# EAGLE design fridge_hack (EAGLE 9.0.1)
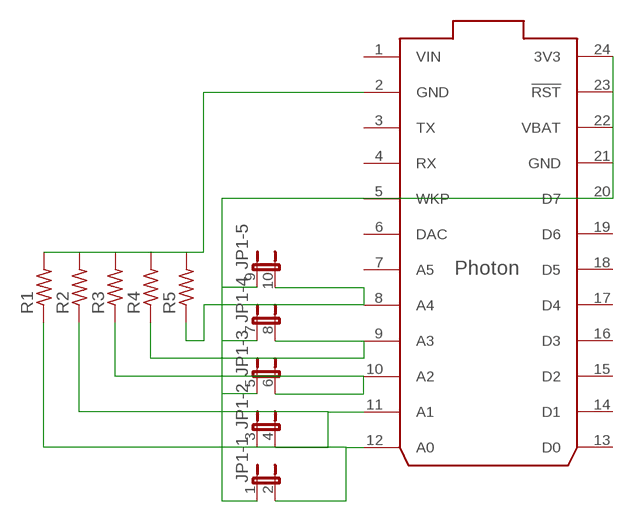
[diagram p0: schematic, sheet 1]

## Parts
JP1  JP5QE  [JP5Q]
R1  R-US_0309/12  [0309/12]
R2  R-US_0309/12  [0309/12]
R3  R-US_0309/12  [0309/12]
R4  R-US_0309/12  [0309/12]
R5  R-US_0309/12  [0309/12]
U$1  PHOTON_WITH_HEADERS  [PHOTON]

## Nets
N$1: R1.2 R2.2 R3.2 R4.2 R5.2 U$1.2(GND)
N$2: JP1.1 JP1.3 JP1.5 JP1.7 JP1.9 U$1.24(3V3)
N$3: JP1.10 R5.1 U$1.8(A4)
N$4: JP1.8 R4.1 U$1.9(A3)
N$5: JP1.6 R3.1 U$1.10(A2)
N$6: JP1.4 R2.1 U$1.11(A1)
N$7: JP1.2 R1.1 U$1.12(A0)
Unconnected: U$1.3(TX) U$1.4(RX) U$1.5(WKP) U$1.6(DAC) U$1.7(A5) U$1.13(D0) U$1.14(D1) U$1.15(D2) U$1.16(D3) U$1.17(D4) U$1.18(D5) U$1.19(D6) U$1.20(D7) U$1.23(!RST)

## Power pins joined to a net without a drawn wire
GND: U$1.21(GND)
VBAT: U$1.22(VBAT)
VIN: U$1.1(VIN)

## Library data of the parts
JP1 = jumper:JP5QE: JUMPER
R1-R5 = resistor:R-US_: RESISTOR, American symbol
U$1 = Particle-Devices:PHOTON: Particle Photon Wi-Fi through-hole development board footprint Product datasheet: here <https://docs.particle.io/datasheets/photon-(wifi)/photon-datasheet/> Design files: here <https://github.com/particle-iot/photon> Github : Particle devices library <https://github.com/particle-iot/hardware-libraries/tree/master/Eagle>

## Board
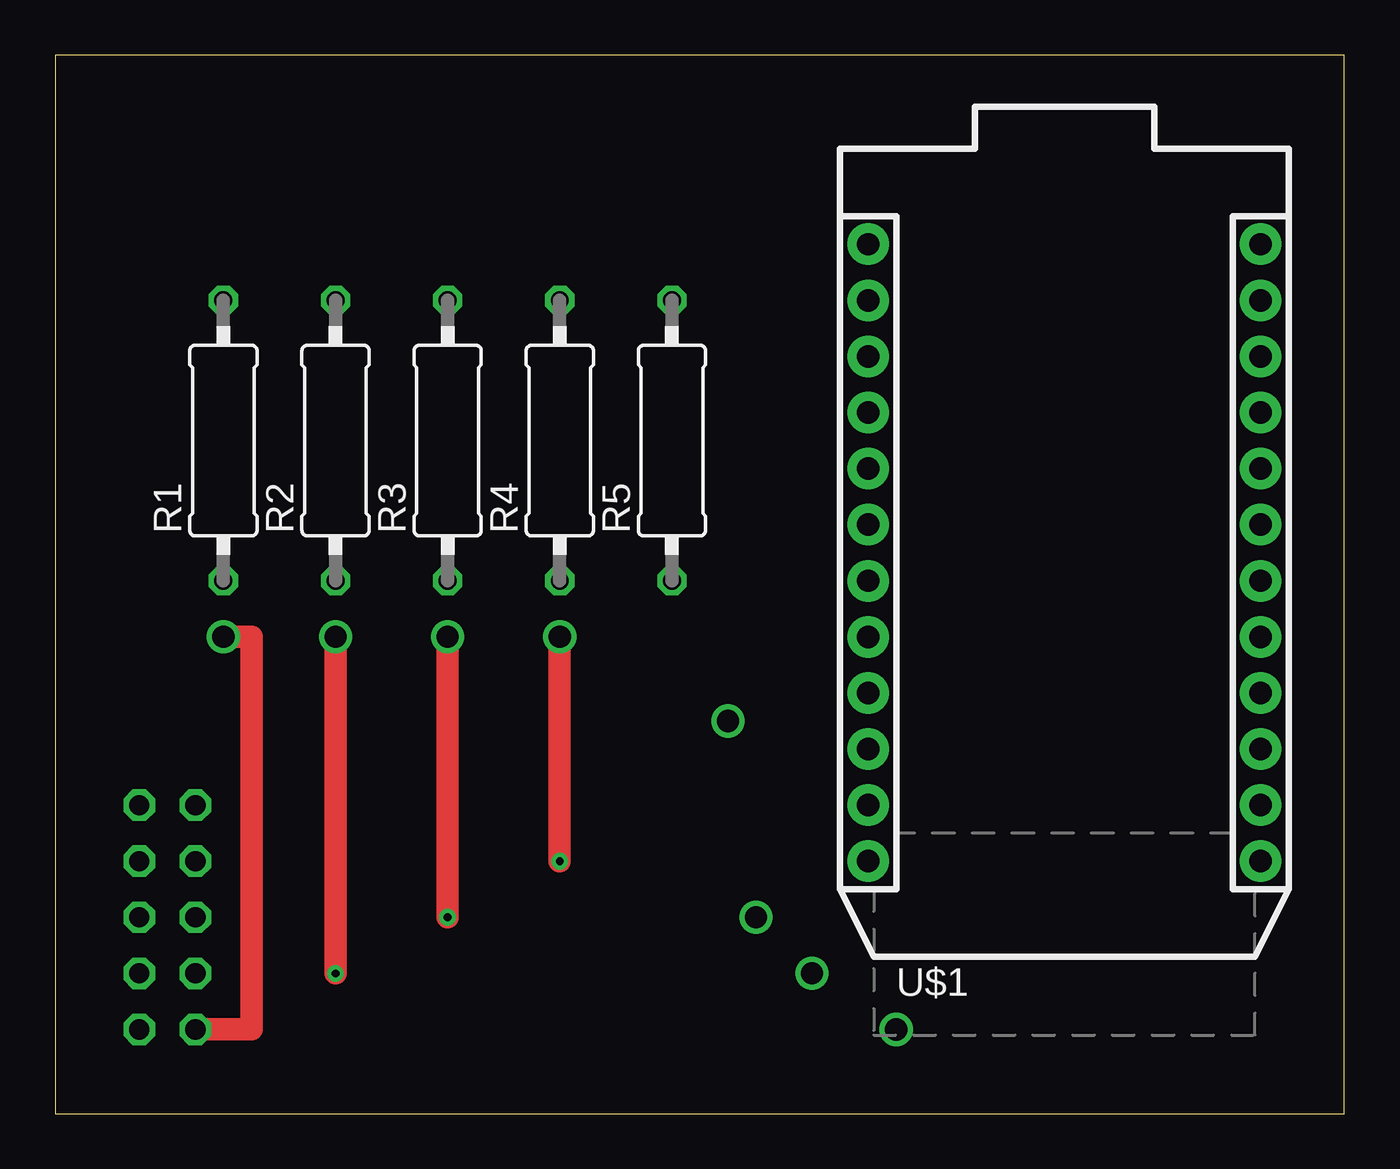
[diagram p1: board, top side]
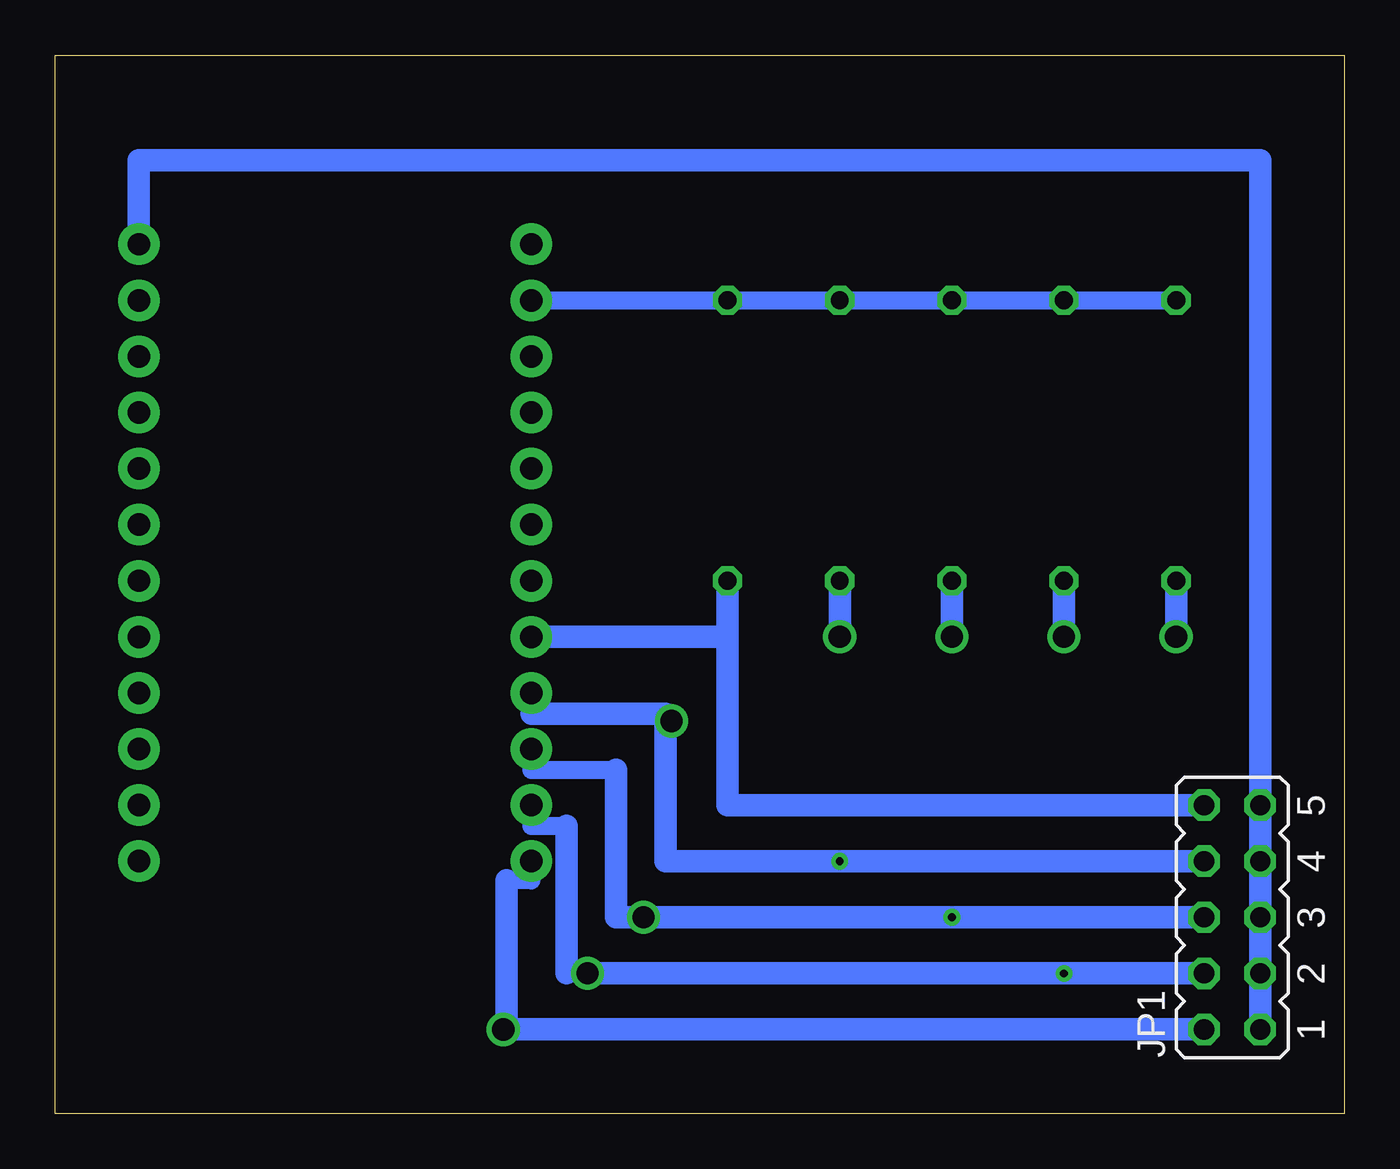
[diagram p2: board, bottom side, seen from below]

Size 58.4 x 47.93 mm. Coordinates in mm from the lower left corner, seen from the top.
Outline: 0,0 58.4,0 58.4,47.93 0,47.93 0,0
Copper layers (1*16): Top 0.035mm / dielectric 1.5mm / Bottom 0.035mm
Design rules "default": minimum track width 6mil, minimum drill 0.35mm, track to track 6mil, track to pad 6mil, pad to pad 6mil, via to via 6mil, smd to smd 6mil, copper to edge 40mil, drill to drill 6mil, minimum pad ring 10mil, minimum via ring 8mil, stop-mask expansion 4mil, vias tented up to drill 0mil, thermal gap 10mil

### Footprints (pad centres in the part's own frame; a part is rotated, then mirrored left to right if it is on the bottom)
JP5Q = drill 0.914 octagon: 1 -5.08,-1.27; 2 -5.08,1.27; 3 -2.54,-1.27; 4 -2.54,1.27; 5 0,-1.27; 6 0,1.27; 7 2.54,-1.27; 8 2.54,1.27; 9 5.08,-1.27; 10 5.08,1.27
0309/12 = drill 0.813 octagon: 1 -6.35,0; 2 6.35,0
PHOTON = drill 1.016 pad 1.88: 1 1.27,33.02; 2 1.27,30.48; 3 1.27,27.94; 4 1.27,25.4; 5 1.27,22.86; 6 1.27,20.32; 7 1.27,17.78; 8 1.27,15.24; 9 1.27,12.7; 10 1.27,10.16; 11 1.27,7.62; 12 1.27,5.08; 13 19.05,5.08; 14 19.05,7.62; 15 19.05,10.16; 16 19.05,12.7; 17 19.05,15.24; 18 19.05,17.78; 19 19.05,20.32; 20 19.05,22.86; 21 19.05,25.4; 22 19.05,27.94; 23 19.05,30.48; 24 19.05,33.02

### Placement (x,y rotation side)
JP1  5.08,8.89 90 bottom
R1  7.62,30.48 90 top
R2  12.7,30.48 90 top
R3  17.78,30.48 90 top
R4  22.86,30.48 90 top
R5  27.94,30.48 90 top
U$1  35.56,6.35 0 top

### Tracks (layer width: path | path; a pad name or v marks a point on that pad's centre or on a via)
N$1
  Bottom 0.813: U$1.2 R5.2 R4.2 R3.2 R2.2 R1.2
N$2
  Bottom 1.016: JP1.1 JP1.3 JP1.5 JP1.7 JP1.9 3.81,43.18 54.61,43.18 U$1.24
N$3
  Bottom 1.016: JP1.10 27.94,13.97 27.94,20.32 27.94,21.59 | 27.94,21.59 U$1.8 | R5.1 27.94,21.59
N$4  (via drill 0.35, 1)
  Top 1.016: v22.86,11.43 v22.86,21.59
  Bottom 0.813: U$1.9 36.83,18.11
  Bottom 1.016: 36.83,18.11 30.76,18.11 30.76,11.43 v22.86,11.43 JP1.8 | R4.1 v22.86,21.59
N$5  (via drill 0.35, 1)
  Top 1.016: v17.78,8.89 v17.78,21.59
  Bottom 0.813: U$1.10 36.83,15.57 33,15.57
  Bottom 1.016: JP1.6 v17.78,8.89 v31.75,8.89 33,8.89 33,15.57 | R3.1 v17.78,21.59
N$6  (via drill 0.35, 1)
  Top 1.016: v12.7,6.35 v12.7,21.59
  Bottom 0.813: U$1.11 36.83,13.03 35.23,13.03 | 35.23,6.35 v34.29,6.35
  Bottom 1.016: v34.29,6.35 v12.7,6.35 JP1.4 | 35.23,13.03 35.23,6.35 | R2.1 v12.7,21.59
N$7  (via drill 1)
  Top 1.016: JP1.2 8.89,3.81 8.89,21.59 v7.62,21.59
  Bottom 0.813: U$1.12 36.83,10.57 37.95,10.57
  Bottom 1.016: 37.95,10.57 37.95,3.81 12.7,3.81 JP1.2 | R1.1 v7.62,21.59
N$8  (via drill 1)
  other vias: 30.48,17.78
N$9  (via drill 1)
  other vias: 38.1,3.81